# EAGLE design modbus (EAGLE 9.3.0)
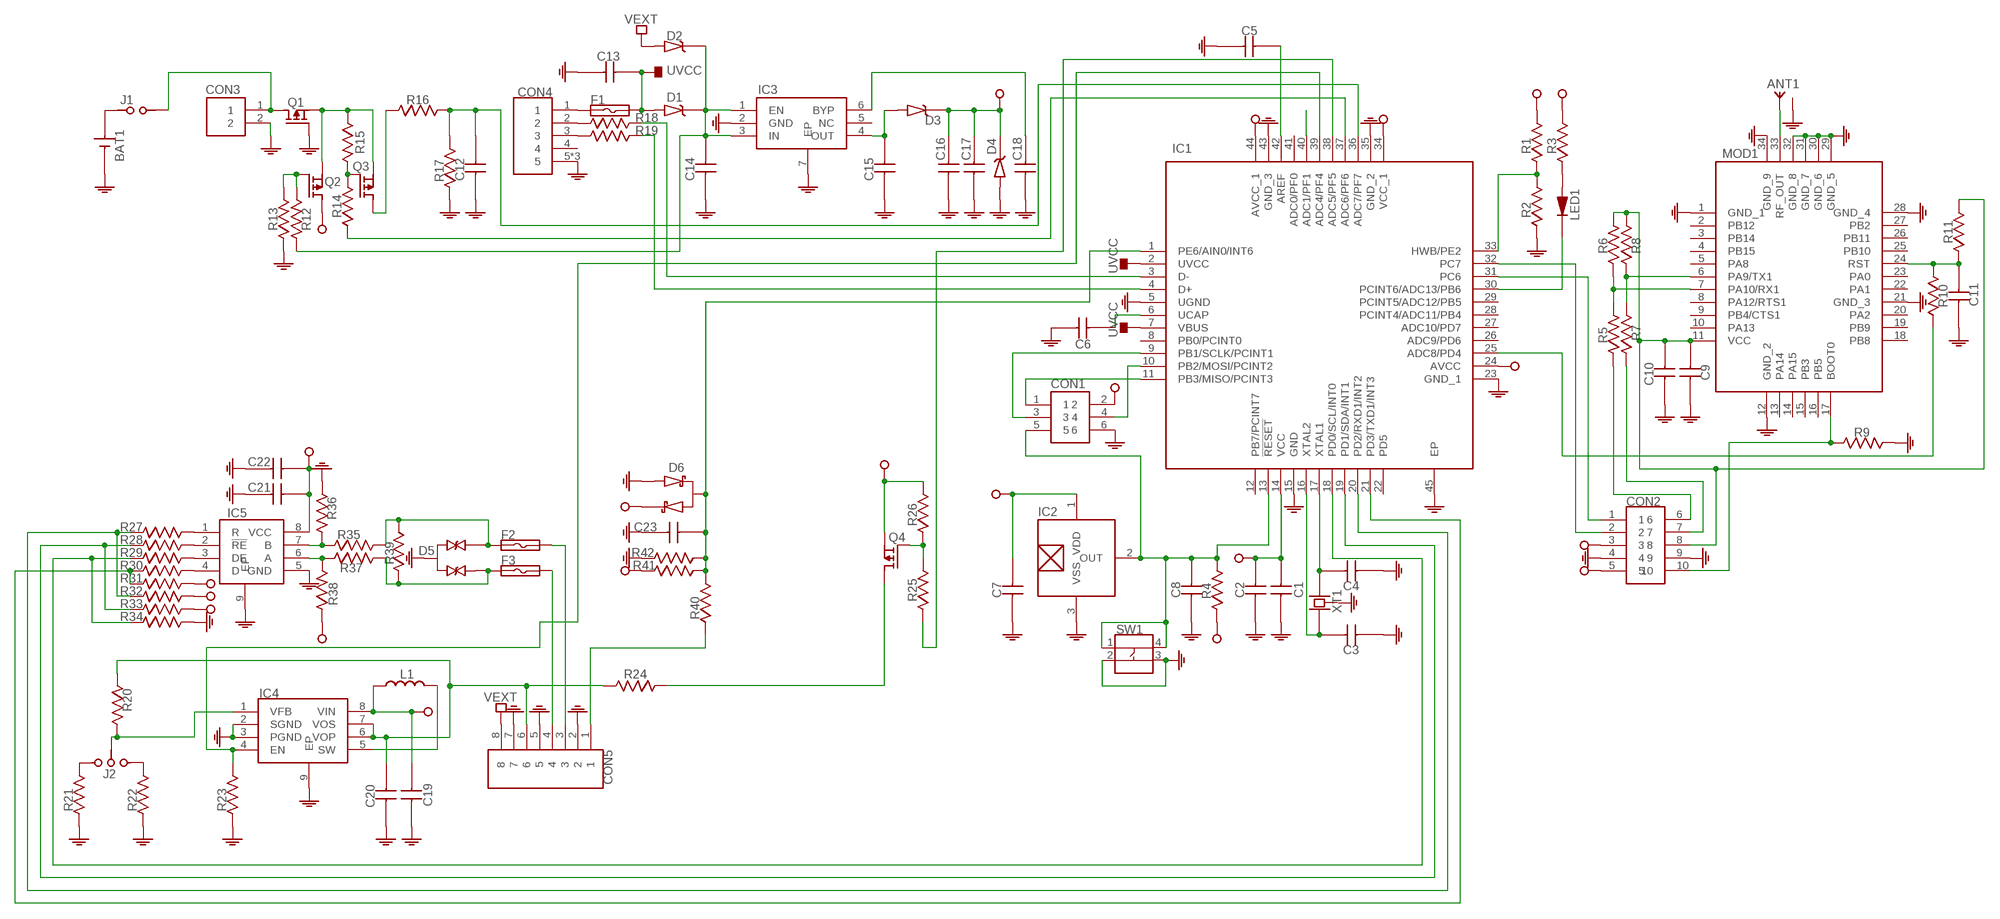
[diagram p0: schematic, sheet 1]

## Parts
ANT1  SMA-RF  [SMA-RF]
BAT1  211P-C-HOLDER  [211P-C-HOLDER]
C1  CAPACITOR-0603  [0603]
C2  CAPACITOR-0603  [0603]
C3  CAPACITOR-0603  [0603]
C4  CAPACITOR-0603  [0603]
C5  CAPACITOR-0603  [0603]
C6  CAPACITOR-0603  [0603]
C7  CAPACITOR-0603  [0603]
C8  CAPACITOR-0603  [0603]
C9  CAPACITOR-0603  [0603]
C10  CAPACITOR-0603  [0603]
C11  CAPACITOR-0603  [0603]
C12  CAPACITOR-0603  [0603]
C13  CAPACITOR-0603  [0603]
C14  CAPACITOR-0805  [0805]
C15  CAPACITOR-0805  [0805]
C16  CAPACITOR-0603  [0603]
C17  CAPACITOR-0603  [0603]
C18  CAPACITOR-0603  [0603]
C19  CAPACITOR-0805  [0805]
C20  CAPACITOR-0805  [0805]
C21  CAPACITOR-0603  [0603]
C22  CAPACITOR-0603  [0603]
C23  CAPACITOR-0603  [0603]
CON1  ISP  [ISP]
CON2  HEADER-10P-2R-DIP-2_54MM  [HEADER-10P-2R-DIP-2_54MM]
CON3  JST-PH-2-2.0MM  [JST-PH-2-2.0MM]
CON4  USB-MICRO-DIP-VER  [USB-MICRO-DIP-VER]
CON5  CON-3_50MM-8P-1985250  [CON-3_50MM-8P-1985250]
D1  DIODE-SCHOTTKY  [SOD123-DIODE]
D2  DIODE-SCHOTTKY  [SOD123-DIODE]
D3  DIODE-SCHOTTKY  [SOD123-DIODE]
D4  ZENER-SOD123  [SOD123-DIODE]
D5  TVS-DIODE-3P  [SOT23-3]
D6  SCHOTTKY-SERIE-3P  [SOT23-3]
F1  FUSE-1206  [1206]
F2  FUSE-1206  [1206]
F3  FUSE-1206  [1206]
IC1  ATMEGA32U4-MU  [QFN-44]
IC2  S-5712-SOT23-3  [SOT23-3]
IC3  MIC5219-VDFN-6  [VDFN-6]
IC4  MCP1640-DFN-8  [DFN-8-2X3]
IC5  SN65HVD72DRB  [VSON-8]
J1  JUMPER  [HEADER-2P-DIP-2_54MM]
J2  JUMPER-3P  [HEADER-3P-DIP-2_54MM]
L1  INDUCTOR-0520-0630  [INDUCTOR-0520-0630]
LED1  LED-0603  [LED-0603]
MOD1  RAK811  [RAK811]
Q1  P-MOSFET  [SOT23-3]
Q2  P-MOSFET  [SOT23-3]
Q3  P-MOSFET  [SOT23-3]
Q4  P-MOSFET  [SOT23-3]
R1  RESISTOR-0603  [0603]
R2  RESISTOR-0603  [0603]
R3  RESISTOR-0603  [0603]
R4  RESISTOR-0603  [0603]
R5  RESISTOR-0603  [0603]
R6  RESISTOR-0603  [0603]
R7  RESISTOR-0603  [0603]
R8  RESISTOR-0603  [0603]
R9  RESISTOR-0603  [0603]
R10  RESISTOR-0603  [0603]
R11  RESISTOR-0603  [0603]
R12  RESISTOR-0603  [0603]
R13  RESISTOR-0603  [0603]
R14  RESISTOR-0603  [0603]
R15  RESISTOR-0603  [0603]
R16  RESISTOR-0603  [0603]
R17  RESISTOR-0603  [0603]
R18  RESISTOR-0603  [0603]
R19  RESISTOR-0603  [0603]
R20  RESISTOR-0603  [0603]
R21  RESISTOR-0603  [0603]
R22  RESISTOR-0603  [0603]
R23  RESISTOR-0603  [0603]
R24  RESISTOR-0603  [0603]
R25  RESISTOR-0603  [0603]
R26  RESISTOR-0603  [0603]
R27  RESISTOR-0603  [0603]
R28  RESISTOR-0603  [0603]
R29  RESISTOR-0603  [0603]
R30  RESISTOR-0603  [0603]
R31  RESISTOR-0603  [0603]
R32  RESISTOR-0603  [0603]
R33  RESISTOR-0603  [0603]
R34  RESISTOR-0603  [0603]
R35  RESISTOR-0805  [0805]
R36  RESISTOR-0603  [0603]
R37  RESISTOR-0805  [0805]
R38  RESISTOR-0603  [0603]
R39  RESISTOR-JMP-2_54MM  [HEADER-2P-DIP-2_54MM]
R40  RESISTOR-0805  [0805]
R41  RESISTOR-JMP-2_54MM  [HEADER-2P-DIP-2_54MM]
R42  RESISTOR-JMP-2_54MM  [HEADER-2P-DIP-2_54MM]
SW1  BUTTON-4P-SMD-5X5  [BUTTON-4P-SMD-5X5]
XT1  CRYSTAL-5032-4P  [CRYSTAL-5032-4P]

## Nets
GND: ANT1.2(GND) ANT1.3(GND) ANT1.4(GND) ANT1.5(GND) BAT1.2(-) C1.1 C2.1 C3.1 C4.1 C5.1 C6.1 C7.1 C8.1 C9.1 C10.1 C11.1 C12.1 C13.1 C14.1 C15.1 C16.1 C17.1 C18.1 C19.1 C20.1 C21.1 C22.1 C23.1 CON1.6 CON2.4 CON2.9 CON3.2 CON4.5 CON4.6 CON4.7 CON5.2 CON5.5 CON5.7 D4.2(A) D5.3 D6.1 IC1.5(UGND) IC1.15(GND) IC1.23(GND_1) IC1.35(GND_2) IC1.43(GND_3) IC1.45(EP) IC2.3(VSS) IC3.2(GND) IC3.7(EP) IC4.2(SGND) IC4.3(PGND) IC4.9(EP) IC5.5(GND) IC5.9(EP) MOD1.1(GND_1) MOD1.12(GND_2) MOD1.21(GND_3) MOD1.28(GND_4) MOD1.29(GND_5) MOD1.30(GND_6) MOD1.31(GND_7) MOD1.32(GND_8) MOD1.34(GND_9) Q1.1(G) R2.1 R9.2 R13.1 R17.1 R21.1 R22.1 R23.1 R34.2 R36.1 R42.1 SW1.2 SW1.3
N$1: IC5.1(R) R27.2
N$2: C11.2 MOD1.24(RST) R10.1 R11.1
N$3: CON1.1 IC1.11(PB3/MISO/PCINT3)
N$4: ANT1.1(ANT) MOD1.33(RF_OUT)
N$5: CON5.4 F3.2
N$6: MOD1.7(PA10/RX1) R5.2 R6.1
N$7: MOD1.6(PA9/TX1) R7.2 R8.1
N$8: IC5.2(!RE) R28.2
N$9: CON1.4 IC1.10(PB2/MOSI/PCINT2)
N$10: C3.2 IC1.16(XTAL2) XT1.1
N$11: CON2.1 IC1.31(PC6)
N$12: C4.2 IC1.17(XTAL1) XT1.3
N$13: C9.2 C10.2 CON2.8 MOD1.11(VCC) R6.2 R8.2 R11.2
N$14: CON2.7 R7.1
N$15: C20.2 CON5.6 IC4.6(VOP) IC4.7(VOS) R20.1 R24.2
N$16: IC1.25(ADC8/PD4) R10.2
N$17: IC5.3(DE) R29.2
N$18: IC5.4(D) R30.2
N$19: IC1.30(PCINT6/ADC13/PB6) LED1.1(K)
N$20: CON4.1 F1.1
N$21: CON5.3 F2.2
N$22: IC4.1(VFB) J2.2 R20.2
N$23: IC5.7(B) R35.1 R36.2
N$24: IC5.6(A) R37.1 R38.2
N$25: CON5.1 R40.1
N$26: D5.2 F2.1 R35.2 R39.2
N$27: IC1.40(ADC1/PF1)
N$28: Q4.3(D) R24.1
N$29: CON2.2 IC1.32(PC7)
N$30: D5.1 F3.1 R37.2 R39.1
N$31: C5.2 IC1.42(AREF)
N$32: Q3.1(G) R14.2 R15.2
N$34: C6.2 IC1.6(UCAP)
N$35: LED1.2(A) R3.1
N$36: C12.2 IC1.36(ADC7/PF7) R16.2 R17.2
N$37: C18.2 IC3.6(BYP)
N$38: C14.2 D1.1(K) D2.1(K) IC3.1(EN) IC3.3(IN) R12.1
N$39: J2.1 R22.2
N$40: C15.2 D3.2(A) IC3.4(OUT)
N$41: CON4.2 R18.1
N$42: CON4.3 R19.1
N$43: IC1.3(D-) R18.2
N$44: IC1.4(D+) R19.2
N$45: CON1.3 IC1.9(PB1/SCLK/PCINT1)
N$46: Q4.1(G) R25.2 R26.1
N$47: IC1.37(ADC6/PF6) R14.1
N$49: J2.3 R21.2
N$50: IC1.38(ADC5/PF5) R25.1
N$51: BAT1.1(+) J1.1
N$52: IC1.18(PD0/SCL/INT0) R29.1 R34.1
N$53: Q2.1(G) R12.2 R13.2
N$54: IC1.19(PD1/SDA/INT1) R28.1 R33.1
N$55: CON3.1 J1.2 Q1.3(D)
N$56: C23.2 D6.3 IC1.1(PE6/AIN0/INT6) R40.2 R41.2 R42.2
N$57: IC1.20(PD2/RXD1/INT2) R27.1 R32.1
N$58: Q1.2(S) Q2.2(S) Q3.2(S) R15.1
N$59: Q3.3(D) R16.1
N$60: CON2.6 R5.1
N$61: IC1.33(HWB/PE2) R1.1 R2.2
N$62: IC1.21(PD3/TXD1/INT3) R30.1 R31.1
N$63: CON2.10 MOD1.17(BOOT0) R9.1
N$64: C8.2 CON1.5 IC1.13(!RESET) IC2.2(OUT) R4.2 SW1.1 SW1.4
N$65: IC4.5(SW) L1.2
N$66: IC1.39(ADC4/PF4) IC4.4(EN) R23.2
UVCC: C13.2 D1.2(A) F1.2 IC1.2(UVCC) IC1.7(VBUS)
VCC: C1.2 C2.2 C7.2 C16.2 C17.2 C19.2 C21.2 C22.2 CON1.2 CON2.3 CON2.5 D3.1(K) D4.1(K) D6.2 IC1.14(VCC) IC1.24(AVCC) IC1.34(VCC_1) IC1.44(AVCC_1) IC2.1(VDD) IC4.8(VIN) IC5.8(VCC) L1.1 Q2.3(D) Q4.2(S) R1.2 R3.2 R4.1 R26.2 R31.2 R32.2 R33.2 R38.1 R41.1
VEXT: CON5.8 D2.2(A)
Unconnected: CON4.4 IC1.8(PB0/PCINT0) IC1.12(PB7/PCINT7) IC1.22(PD5) IC1.26(ADC9/PD6) IC1.27(ADC10/PD7) IC1.28(PCINT4/ADC11/PB4) IC1.29(PCINT5/ADC12/PB5) IC1.41(ADC0/PF0) IC3.5(NC) MOD1.2(PB12) MOD1.3(PB14) MOD1.4(PB15) MOD1.5(PA8) MOD1.8(PA12/RTS1) MOD1.9(PB4/CTS1) MOD1.10(PA13) MOD1.13(PA14) MOD1.14(PA15) MOD1.15(PB3) MOD1.16(PB5) MOD1.18(PB8) MOD1.19(PB9) MOD1.20(PA2) MOD1.22(PA1) MOD1.23(PA0) MOD1.25(PB10) MOD1.26(PB11) MOD1.27(PB2)

## Power pins joined to a net without a drawn wire
GND: XT1.2(GND) XT1.4(GND)

## Library data of the parts
ANT1 = SamacSys_Parts:SMA-RF
BAT1 = SamacSys_Parts:211P-C-HOLDER
C1-C13 C16-C18 C21-C23 = SamacSys_Parts:CAPACITOR-0603
C14 C15 C19 C20 = SamacSys_Parts:CAPACITOR-0805
CON1 = SamacSys_Parts:ISP
CON2 = SamacSys_Parts:HEADER-10P-2R-DIP-2_54MM
CON3 = SamacSys_Parts:JST-PH-2-2.0MM
CON4 = SamacSys_Parts:USB-MICRO-DIP-VER
CON5 = SamacSys_Parts:CON-3_50MM-8P-1985250
D1-D3 = SamacSys_Parts:DIODE-SCHOTTKY
D4 = SamacSys_Parts:ZENER-SOD123
D5 = SamacSys_Parts:TVS-DIODE-3P
D6 = SamacSys_Parts:SCHOTTKY-SERIE-3P
F1-F3 = SamacSys_Parts:FUSE-1206
IC1 = SamacSys_Parts:ATMEGA32U4-MU
IC2 = SamacSys_Parts:S-5712-SOT23-3
IC3 = SamacSys_Parts:MIC5219-VDFN-6
IC4 = SamacSys_Parts:MCP1640-DFN-8
IC5 = SamacSys_Parts:SN65HVD72DRB
J1 = SamacSys_Parts:JUMPER
J2 = SamacSys_Parts:JUMPER-3P
L1 = SamacSys_Parts:INDUCTOR-0520-0630
LED1 = SamacSys_Parts:LED-0603
MOD1 = SamacSys_Parts:RAK811
Q1-Q4 = SamacSys_Parts:P-MOSFET
R1-R34 R36 R38 = SamacSys_Parts:RESISTOR-0603
R35 R37 R40 = SamacSys_Parts:RESISTOR-0805
R39 R41 R42 = SamacSys_Parts:RESISTOR-JMP-2_54MM
SW1 = SamacSys_Parts:BUTTON-4P-SMD-5X5
XT1 = SamacSys_Parts:CRYSTAL-5032-4P

## Board
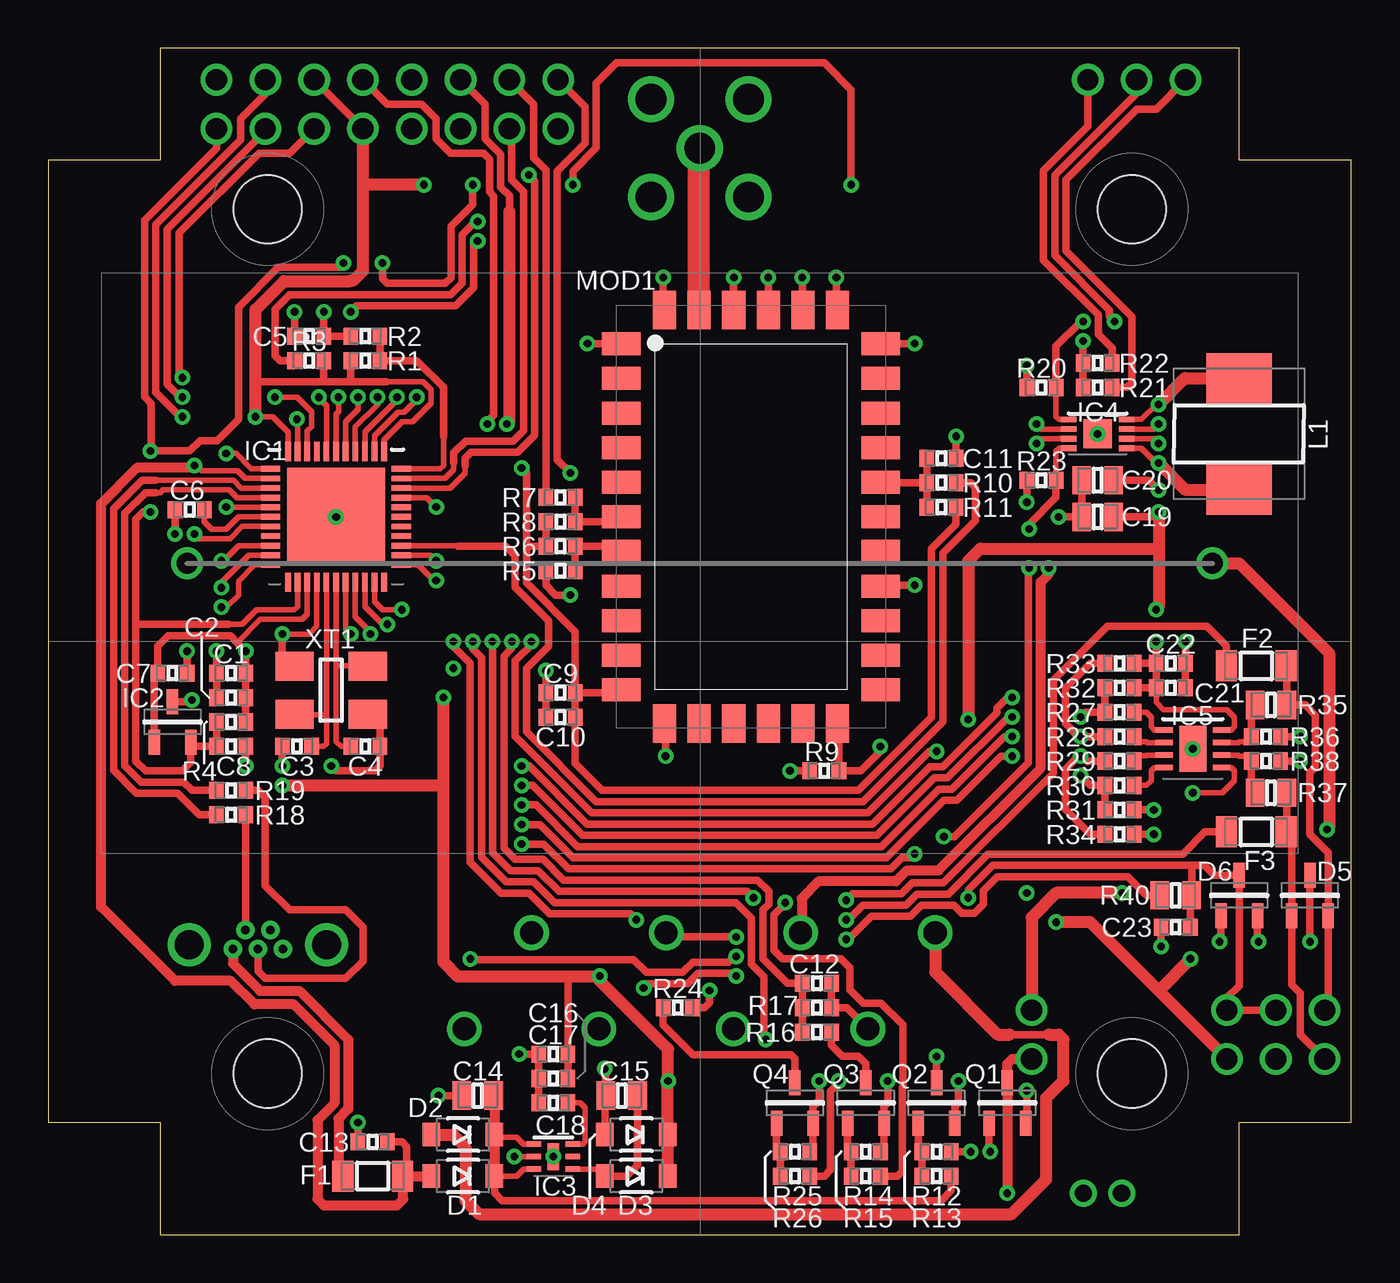
[diagram p1: board, top side]
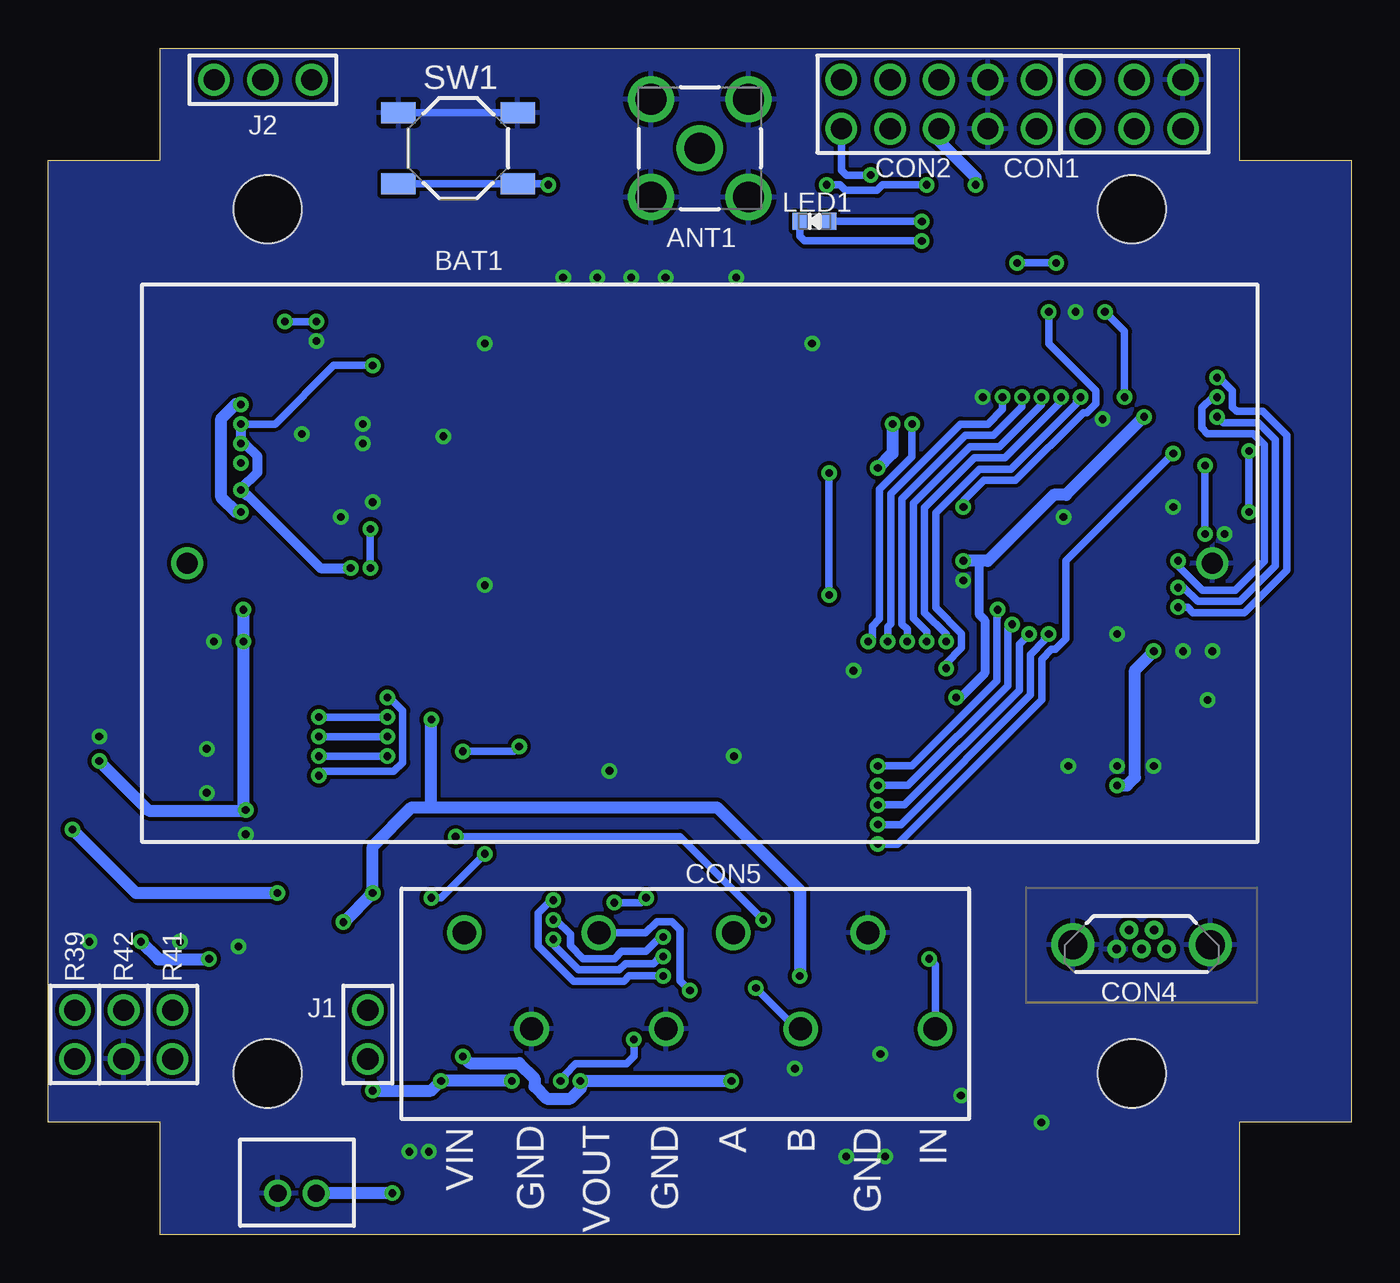
[diagram p2: board, bottom side, seen from below]

Size 67.82 x 61.72 mm. Coordinates in mm from the lower left corner, seen from the top.
Outline: 0,5.84 5.84,5.84 5.84,0 61.98,0 61.98,5.84 67.82,5.84 67.82,55.88 61.98,55.88 61.98,61.72 5.84,61.72 5.84,55.88 0,55.88 0,5.84
Copper layers (1*16): Top 0.035mm / dielectric 1.5mm / Bottom 0.035mm
Design rules "qfn": minimum track width 10mil, minimum drill 0.4mm, track to track 8mil, track to pad 10mil, pad to pad 8mil, via to via 8mil, smd to smd 0mil, copper to edge 0mil, drill to drill 6mil, minimum pad ring 10mil, minimum via ring 8mil, stop-mask expansion 4mil, vias tented up to drill 25mil, thermal gap 10mil
Holes 3.56 mm at 11.43,8.38 56.39,8.38 56.39,53.34 11.43,53.34
bRestrict: area 27.7,52.2 to 28.2,53.2

### Footprints (pad centres in the part's own frame; a part is rotated, then mirrored left to right if it is on the bottom)
SMA-RF = drill 1.6: 1 0,0; 2 -2.54,2.54; 3 -2.54,-2.54; 4 2.54,-2.54; 5 2.54,2.54
211P-C-HOLDER = drill 1.1: 1 -26.67,0; 2 26.67,0
0603 = smd 0.762 x 0.889: 1 -0.762,0; 2 0.762,0
0805 = smd 0.97 x 1.47: 1 -0.83,0; 2 0.83,0
ISP = drill 1.1 pad 1.65: 1 0,0; 2 2.54,0; 3 0,-2.54; 4 2.54,-2.54; 5 0,-5.08; 6 2.54,-5.08
HEADER-10P-2R-DIP-2_54MM = drill 1.1 pad 1.65: 1 0,0; 2 2.54,0; 3 5.08,0; 4 7.62,0; 5 10.16,0; 6 0,2.54; 7 2.54,2.54; 8 5.08,2.54; 9 7.62,2.54; 10 10.16,2.54
JST-PH-2-2.0MM = drill 0.9: 1 -1,0; 2 1,0
USB-MICRO-DIP-VER = drill 0.45: 1 -1.3,0; 2 -0.65,-1; 3 0,0; 4 0.65,-1; 5 1.3,0 | drill 1.5: 6 -3.575,-0.22; 7 3.575,-0.22
CON-3_50MM-8P-1985250 = drill 1.2: 1 12.25,-2.5; 2 8.75,2.5; 3 5.25,-2.5; 4 1.75,2.5; 5 -1.75,-2.5; 6 -5.25,2.5; 7 -8.75,-2.5; 8 -12.25,2.5
SOD123-DIODE = smd 0.91 x 1.22: 1 -1.635,0; 2 1.635,0
SOT23-3 = smd 1.3 x 0.6: 1 -1.05,0.95; 2 -1.05,-0.95; 3 1.05,0
1206 = smd 1.1 x 1.6: 1 -1.55,0; 2 1.55,0
QFN-44 = smd 1 x 0.3: 1 -3.4,2.5; 2 -3.4,2; 3 -3.4,1.5; 4 -3.4,1; 5 -3.4,0.5; 6 -3.4,0; 7 -3.4,-0.5; 8 -3.4,-1; 9 -3.4,-1.5; 10 -3.4,-2; 11 -3.4,-2.5; 23 3.4,-2.5; 24 3.4,-2; 25 3.4,-1.5; 26 3.4,-1; 27 3.4,-0.5; 28 3.4,0; 29 3.4,0.5; 30 3.4,1; 31 3.4,1.5; 32 3.4,2; 33 3.4,2.5 | smd 0.3 x 1: 12 -2.5,-3.4; 13 -2,-3.4; 14 -1.5,-3.4; 15 -1,-3.4; 16 -0.5,-3.4; 17 0,-3.4; 18 0.5,-3.4; 19 1,-3.4; 20 1.5,-3.4; 21 2,-3.4; 22 2.5,-3.4; 34 2.5,3.4; 35 2,3.4; 36 1.5,3.4; 37 1,3.4; 38 0.5,3.4; 39 0,3.4; 40 -0.5,3.4; 41 -1,3.4; 42 -1.5,3.4; 43 -2,3.4; 44 -2.5,3.4 | smd 5.1 x 5.1: 45 0,0
VDFN-6 = smd 0.75 x 0.3: 1 -1.025,0.65; 2 -1.025,0; 3 -1.025,-0.65; 4 1.025,-0.65; 5 1.025,0; 6 1.025,0.65 | smd 0.6 x 1.4: 7 0,0
DFN-8-2X3 = smd 0.8 x 0.3: 1 -1.5,0.75; 2 -1.5,0.25; 3 -1.5,-0.25; 4 -1.5,-0.75; 5 1.5,-0.75; 6 1.5,-0.25; 7 1.5,0.25; 8 1.5,0.75 | smd 1.5 x 1.5: 9 0,0
VSON-8 = smd 0.9 x 0.3: 1 -1.5,0.975; 2 -1.5,0.325; 3 -1.5,-0.325; 4 -1.5,-0.975; 5 1.5,-0.975; 6 1.5,-0.325; 7 1.5,0.325; 8 1.5,0.975 | smd 1.4 x 2.4: 9 0,0
HEADER-2P-DIP-2_54MM = drill 1.1 pad 1.65: 1 0,-1.27; 2 0,1.27
HEADER-3P-DIP-2_54MM = drill 1.1 pad 1.65: 1 0,-2.54; 2 0,0; 3 0,2.54
INDUCTOR-0520-0630 = smd 2.6 x 3.4: 1 -2.9,0; 2 2.9,0
LED-0603 = smd 0.762 x 0.889: 1 -0.762,0; 2 0.762,0
RAK811 = smd 2 x 1.2: 1 -6.75,9; 2 -6.75,7.2; 3 -6.75,5.4; 4 -6.75,3.6; 5 -6.75,1.8; 6 -6.75,0; 7 -6.75,-1.8; 8 -6.75,-3.6; 9 -6.75,-5.4; 10 -6.75,-7.2; 11 -6.75,-9; 18 6.75,-9; 19 6.75,-7.2; 20 6.75,-5.4; 21 6.75,-3.6; 22 6.75,-1.8; 23 6.75,0; 24 6.75,1.8; 25 6.75,3.6; 26 6.75,5.4; 27 6.75,7.2; 28 6.75,9 | smd 1.2 x 2: 12 -4.5,-10.75; 13 -2.7,-10.75; 14 -0.9,-10.75; 15 0.9,-10.75; 16 2.7,-10.75; 17 4.5,-10.75; 29 4.5,10.75; 30 2.7,10.75; 31 0.9,10.75; 32 -0.9,10.75; 33 -2.7,10.75; 34 -4.5,10.75
BUTTON-4P-SMD-5X5 = smd 1.8 x 1.1: 1 -3.1,1.85; 2 -3.1,-1.85; 3 3.1,-1.85; 4 3.1,1.85
CRYSTAL-5032-4P = smd 2 x 1.5: 1 -1.9,-1.25; 2 1.9,-1.25; 3 1.9,1.25; 4 -1.9,1.25

### Placement (x,y rotation side)
ANT1  33.91,56.52 0 bottom
BAT1  33.91,34.92 0 bottom
C1  9.53,29.21 0 top
C2  9.53,27.94 0 top
C3  12.95,25.4 0 top
C4  16.51,25.4 180 top
C5  13.59,46.74 180 top
C6  7.37,37.72 0 top
C7  6.48,29.21 180 top
C8  9.53,25.4 180 top
C9  26.67,28.19 0 top
C10  26.67,26.92 0 top
C11  46.48,40.39 180 top
C12  40.01,13.08 180 top
C13  16.89,4.83 0 top
C14  22.35,7.24 0 top
C15  29.84,7.24 0 top
C16  26.29,8.13 0 top
C17  26.29,9.4 0 top
C18  26.29,6.86 0 top
C19  54.61,37.34 0 top
C20  54.61,39.24 0 top
C21  58.42,28.45 180 top
C22  58.42,29.72 180 top
C23  58.67,16 0 top
CON1  13.84,57.53 90 bottom
CON2  26.54,57.53 0 bottom
CON3  54.86,2.16 180 bottom
CON4  10.92,14.86 180 bottom
CON5  33.91,13.21 0 bottom
D1  21.59,3.05 180 top
D2  21.59,5.21 180 top
D3  30.61,3.05 180 top
D4  30.61,5.21 180 top
D5  65.66,17.65 90 top
D6  61.98,17.65 90 top
F1  16.89,3.05 0 top
F2  62.87,29.59 180 top
F3  62.87,20.95 180 top
IC1  14.99,37.34 0 top
IC2  6.48,26.67 90 top
IC3  26.29,4.06 0 top
IC4  54.61,41.66 0 top
IC5  59.56,25.27 0 top
J1  51.18,10.41 180 bottom
J2  56.64,60.07 90 bottom
L1  61.98,41.66 270 top
LED1  27.94,52.7 0 bottom
MOD1  36.58,37.34 0 top
Q1  49.91,6.86 90 top
Q2  46.23,6.86 90 top
Q3  42.55,6.86 90 top
Q4  38.86,6.86 90 top
R1  16.51,45.47 180 top
R2  16.51,46.74 0 top
R3  13.59,45.47 0 top
R4  9.53,26.67 180 top
R5  26.67,34.54 0 top
R6  26.67,35.81 180 top
R7  26.67,38.35 0 top
R8  26.67,37.08 180 top
R9  40.39,24.13 180 top
R10  46.48,39.12 0 top
R11  46.48,37.85 0 top
R12  46.23,3.05 180 top
R13  46.23,4.32 180 top
R14  42.55,3.05 180 top
R15  42.55,4.32 180 top
R16  40.01,10.54 180 top
R17  40.01,11.81 180 top
R18  9.53,21.84 180 top
R19  9.53,23.11 180 top
R20  51.69,44.07 0 top
R21  54.61,44.07 0 top
R22  54.61,45.34 0 top
R23  51.69,39.24 0 top
R24  32.77,11.81 0 top
R25  38.86,3.05 180 top
R26  38.86,4.32 0 top
R27  55.75,27.18 0 top
R28  55.75,25.91 0 top
R29  55.75,24.64 0 top
R30  55.75,23.37 0 top
R31  55.75,22.1 0 top
R32  55.75,28.45 0 top
R33  55.75,29.72 0 top
R34  55.75,20.83 0 top
R35  63.63,27.56 0 top
R36  63.37,25.91 180 top
R37  63.63,22.99 0 top
R38  63.37,24.64 180 top
R39  66.42,10.41 0 bottom
R40  58.67,17.65 0 top
R41  61.34,10.41 0 bottom
R42  63.88,10.41 0 bottom
SW1  46.48,56.52 180 bottom
XT1  14.73,28.32 0 top

### Tracks (layer width: path | path; a pad name or v marks a point on that pad's centre or on a via)
GND  (via drill 0.4)
  Top 0.292: IC1.43 12.99,42.39 v12.95,42.42 | IC1.35 16.99,41.5 16.99,41.57 18.21,42.79 18.53,42.79 19.18,43.43 v19.18,43.56 | IC1.5 9.28,37.84 v9.27,37.85 | IC1.15 13.99,31.64 13.58,31.24 v12.2,31.24 v12.19,31.24 | IC3.2 v24.26,4.06 | IC1.23 19.26,34.84 20.07,34.04 v20.19,34.04 | IC4.2 51.69,41.91 v51.44,42.16 | IC4.3 51.69,41.41 v51.44,41.15 | IC5.5 61.55,24.3 61.72,24.13 61.72,23.62 61.09,22.99 v59.56,22.99
  Top 0.381: C3.1 v12.19,24.38 | v14.73,24.38 14.99,24.13 17.02,24.13 17.27,24.38 C4.1 17.27,26.43 XT1.2 | C8.1 v10.29,24.38 | C7.1 v7.24,30.35 | IC2.3 7.4,27.72 v7.49,27.81 | v8.76,30.35 C1.1 C2.1 | MOD1.34 32,48.16 v32,49.78 | MOD1.1 29.81,46.35 v28.07,46.35 | MOD1.32 35.68,49.77 v35.69,49.78 | MOD1.31 v37.48,49.77 v37.47,49.78 | MOD1.30 39.24,48.12 v39.24,49.78 | MOD1.29 41.02,48.14 v41.02,49.78 | MOD1.28 43.34,46.35 v45.09,46.35 | MOD1.21 43.37,33.78 v45.09,33.78 | MOD1.12 32.13,26.53 v32.13,24.89 | C10.1 C9.1 v25.91,29.34 | C6.1 v6.6,36.45 | R9.2 v38.61,24.13 | C14.1 v20.32,7.24 | v16.13,5.84 C13.1 | C18.1 C16.1 C17.1 v24.51,9.4 | D4.2 28.97,7.2 C15.1 29.02,8.58 v28.96,8.64 | CON5.7 41.56,11.81 R17.1 C12.1 | R13.1 v48.01,4.32 | Q1.1 48.96,4.38 v49.02,4.32 | R2.1 C5.1 v14.35,48.01 | C11.1 v47.24,41.53 | v12.19,31.24 12.19,30.21 XT1.4 | C20.1 C19.1 v52.58,37.34 | R23.1 v50.93,38.1 | R21.1 R22.1 v53.85,46.48 | D6.1 61.03,15.31 v60.96,15.24 | C23.1 v57.91,14.99 | C21.1 C22.1 v59.18,30.86 | R36.1 v65.15,25.91 | R34.2 v57.53,20.83 | D5.3 v65.66,15.24
  Bottom 0.381: SW1.2 SW1.3
  other vias: 14.99,37.34 26.29,4.06 59.56,25.27 54.61,41.66
  pour Bottom: 0.13,5.97 0.13,55.75 5.97,55.75 5.97,61.59 61.85,61.59 61.85,55.75 67.69,55.75 67.69,5.97 61.85,5.97 61.85,0.13 5.97,0.13 5.97,5.97
N$1
  Top 0.292: IC5.1 57.57,26.25 57.4,26.42 57.4,26.92 57.15,27.18 R27.2
N$2
  Top 0.381: R10.1 R11.1 | MOD1.24 43.35,39.12 R10.1 | R10.1 C11.2
N$3  (via drill 0.4)
  Top 0.292: IC1.11 10.76,34.84 9.91,33.99 9.91,33.27 9.27,32.64 v9.02,32.64
  Top 0.381: CON1.1 12.57,56.26 10.99,56.26 6.83,52.11 6.83,44.73 v6.99,44.58
  Bottom 0.381: v6.99,44.58 6.87,44.58 6.19,43.89 6.19,43.04 5.97,42.82 4.61,42.82 3.37,41.58 3.37,34.55 5.56,32.36 8.25,32.36 8.53,32.64 v9.02,32.64
N$4
  Top 1.143: MOD1.33 33.88,56.48 ANT1.1
N$5  (via drill 0.4)
  Top 0.381: v35.81,15.49 32.37,15.49 CON5.4 | v41.53,16.38 41.64,16.38 42.4,17.14 44.64,17.14 45.21,17.72 46.84,17.72 48.91,19.79 59.04,19.79 60.2,20.95 F3.2
  Bottom 0.381: v41.53,16.38 41.4,16.38 40.64,15.62 40.64,15.03 39.97,14.36 38.34,14.36 37.97,14.73 36.7,14.73 35.94,15.49 v35.81,15.49
N$6
  Top 0.381: R5.2 R6.1 29.55,35.81 MOD1.7
N$7
  Top 0.381: R7.2 R8.1 29.57,37.08 MOD1.6
N$8
  Top 0.292: IC5.2 57.21,25.6 57.15,25.65 56.77,25.65 R28.2
N$9  (via drill 0.4)
  Top 0.292: IC1.10 10.45,35.34 9.02,33.91 v9.02,33.66
  Top 0.381: CON1.4 11.3,59.33 10.03,58.06 10.03,56.96 5.6,52.53 5.6,43.81 6.87,42.55 v6.99,42.55
  Bottom 0.381: v6.99,42.55 6.68,42.24 4.85,42.24 3.95,41.34 3.95,34.8 5.81,32.94 8.01,32.94 8.72,33.66 v9.02,33.66
N$10
  Top 0.292: IC1.16 14.49,27.05 | 14.49,27.05 14.49,25.54 14.35,25.4 C3.2 | XT1.1 12.85,27.05 14.49,27.05
N$11  (via drill 0.4)
  Top 0.292: IC1.31 20.93,38.84 21.7,39.6 21.7,40.01
  Top 0.381: v25.02,55.12 25.32,54.81 25.32,41.58 24.43,40.69 22,40.69 21.7,40.39 21.7,40.01
  Bottom 0.381: v25.02,55.12 26.29,55.12 26.54,55.37 CON2.1
N$12
  Top 0.292: IC1.17 14.99,29.59 | 14.99,29.59 14.99,25.65 15.24,25.4 C4.2 | XT1.3 16.61,29.59 14.99,29.59
N$13  (via drill 0.4)
  Top 0.381: C9.2 C10.2 27.43,24.51 28.83,23.11 42.16,23.11 45.97,26.92 45.97,35.69 47.24,36.96 R11.2 | C9.2 29.68,28.19 MOD1.11 | R8.2 R6.2 24.89,35.81 | C9.2 27.43,31.37 24.89,33.91 24.89,35.81 | v24.64,39.88 24.89,39.62 24.89,35.81 | CON2.8 22.73,58.8 22.73,57.01 23.55,56.19 23.55,54.49 24,54.04 24,53.21
  Top 0.635: v23.88,42.16 24,42.29 24,53.21
  Bottom 0.635: v23.88,42.16 23.88,40.64 v24.64,39.88
N$14
  Top 0.381: CON2.7 25.27,58.8 25.27,56.01 25.91,55.37 R7.1
N$15  (via drill 0.4)
  Top 0.292: IC4.6 57.53,41.41 v57.78,41.15 | IC4.7 57.53,41.91 v57.78,42.16
  Top 0.381: R20.1 v50.93,45.21 | v57.78,38.73 57.28,39.24 C20.2 | R24.2 34.16,11.81 34.42,12.06 v34.42,12.7
  Top 0.508: v52.07,34.67 52.07,34.37 51.65,33.95 51.65,24.27 46.33,18.95 44.7,18.95 44.13,18.38 40.09,18.38 39.21,17.5 39.21,15.76 CON5.6
  Bottom 0.381: v57.78,42.16 56.01,42.16 52.96,45.21 v50.93,45.21 | v34.42,12.7 34.92,13.21 34.92,15.86 35.36,16.29 36.14,16.29 36.73,15.71 CON5.6
  Bottom 0.508: v57.78,42.16 v57.78,41.15 57.58,41.15 56.92,40.49 56.92,39.65 57.78,38.79 v57.78,38.73 57.5,38.45 57.43,38.45 53.65,34.67 v52.07,34.67
N$16
  Top 0.292: 21.34,35.81 21.31,35.84 IC1.25
  Top 0.381: R10.2 48.01,39.12 48.26,38.86 48.26,37.15 46.56,35.45 46.56,26.68 42.41,22.53 28.52,22.53 24.89,26.16 24.89,29.46 26.04,30.61 26.04,31.94 24.31,33.67 24.31,35.31 23.8,35.81 21.34,35.81
N$17
  Top 0.292: IC5.3 57.14,24.95 57.12,24.93 56.8,24.93 R29.2
N$18
  Top 0.292: IC5.4 57.57,24.3 57.4,24.13 57.4,23.62 57.15,23.37 R30.2
N$19  (via drill 0.4)
  Top 0.292: IC1.30 19.7,38.34 v20.19,37.85
  Top 0.381: v15.75,48.01 16.05,48.31 21.2,48.31 22.14,49.25 22.14,51.48 v22.35,51.69
  Bottom 0.381: LED1.1 28.7,51.94 28.45,51.69 v22.35,51.69 | v15.75,48.01 15.75,46.34 13.3,43.89 13.3,43.23 13.77,42.76 13.96,42.76 17.48,39.24 19.13,39.24 20.17,38.2 20.17,37.87 v20.19,37.85
N$20
  Top 0.508: CON4.1 9.62,14.1 11.04,12.69 13.08,12.69 15.62,10.15 15.62,6.55 15.11,6.04 15.11,3.28 F1.1
N$21  (via drill 0.4)
  Top 0.381: v30.99,12.83 31.22,13.06 33.27,13.06 33.81,13.6 35.68,13.6 v35.81,13.46 | v41.53,17.4 41.86,17.73 44.39,17.73 44.97,18.3 46.6,18.3 52.3,24 52.3,28.83 55.13,31.66 60.29,31.66 61.31,30.63 F2.2
  Bottom 0.381: CON5.3 28.87,10.71 v30.99,12.83 | v35.81,13.46 37.59,13.46 37.86,13.2 40.48,13.2 42.33,15.04 42.33,16.71 41.64,17.4 v41.53,17.4
N$22  (via drill 0.4)
  Top 0.292: IC4.1 52.59,42.41 52.45,42.55 R20.2
  Top 0.381: R20.2 52.45,46.21 53.74,47.5 v53.85,47.5 | v55.5,47.5 55.23,47.77 55.23,48.09 52.38,50.94 52.38,55.11 56.64,59.37 J2.2
  Bottom 0.381: v53.85,47.5 v55.5,47.5
N$23
  Top 0.292: IC5.7 61.92,25.6 61.98,25.65 62.36,25.65 R36.2
  Top 0.381: R36.2 62.61,27.37 R35.1
N$24
  Top 0.292: IC5.6 61.92,24.95 61.98,24.89 62.36,24.89 R38.2
  Top 0.381: R38.2 62.61,23.17 R37.1
N$25  (via drill 0.4)
  Top 0.381: v21.97,14.35 22.02,14.3 30.47,14.3 31.13,13.64 33.02,13.64 33.57,14.18 35.39,14.18 35.69,14.48 v35.81,14.48 | v41.53,15.37 41.64,15.37 42.83,16.56 44.88,16.56 45.45,17.14 47.14,17.14 47.55,16.73 48.21,16.73 48.68,17.2 48.68,17.9 49.4,18.62 56.18,18.62 57.15,17.65 R40.1
  Bottom 0.381: CON5.1 21.66,14.04 v21.97,14.35 | v35.81,14.48 35.94,14.48 36.32,14.1 37.78,14.1 38.1,13.78 40.21,13.78 41.53,15.1 v41.53,15.37
N$26
  Top 0.381: F2.1 64.46,29.55 R35.2 65.41,27.56 65.95,27.02 65.95,24.31 65.66,24.02 65.66,20.83 66.61,19.88 D5.2 66.61,11.87 R39.2
N$27  (via drill 0.4)
  Top 0.292: v14.1,43.56 14.1,43.51 14.49,43.12 IC1.40
  Bottom 0.381: v14.1,43.56 14.32,43.34 14.32,43.23 17.72,39.83 19.37,39.83 21.63,37.56 21.63,32.6 20.29,31.25 20.29,30.53 21.08,29.73 v21.08,29.46
N$28
  Top 0.381: Q4.3 38.86,9.14 38.64,9.36 33.55,9.36 32,10.91 R24.1
N$29
  Top 0.292: IC1.32 20.67,39.34 21.11,39.78 21.11,40.16
  Top 0.381: CON2.2 24.13,57.4 24.13,54.86 24.74,54.25 24.74,41.82 24.19,41.27 21.72,41.27 21.11,40.67 21.11,40.16
N$30
  Top 0.381: R37.2 64.46,21 | 64.46,21 F3.1 | R39.1 65.15,10.41 65.15,12.57 64.71,13.02 D5.1 64.71,20.75 64.46,21
N$31  (via drill 0.4)
  Top 0.292: IC1.42 13.49,41.81 13.72,42.04 13.72,42.8 12.95,43.56 v11.81,43.56
  Top 0.381: C5.2 v12.83,48.01
  Bottom 0.381: v11.81,43.56 11.81,46.99 v12.83,48.01
N$32
  Top 0.381: Q3.1 41.59,4.51 R15.2 R14.2
N$34
  Top 0.292: IC1.6 9.91,37.34 9.27,36.7 8.51,36.7 8.13,37.08 C6.2
N$35  (via drill 0.4)
  Top 0.381: R3.1 12.06,45.47 11.81,45.72 11.81,48.13 12.57,48.9 20.95,48.9 21.55,49.49 21.55,52.02 22.24,52.7 v22.35,52.7
  Bottom 0.381: LED1.2 v22.35,52.7
N$36  (via drill 0.4)
  Top 0.292: IC1.36 16.49,41.63 16.49,41.64 16.49,41.77 18.16,43.44 v18.16,43.56
  Top 0.381: R16.2 R17.2 C12.2 38.48,13.08 37.2,14.37 37.2,16.89 37.5,17.2 37.5,17.86 36.92,18.44 26.83,18.44 25.75,19.52 24.31,19.52 23.72,20.11 23.72,30.1 24.13,30.5 v24.13,30.86
  Bottom 0.381: v24.13,30.86 24.13,31.62 23.97,31.79 23.97,38.53 20.34,42.16 18.92,42.16 18.16,42.93 v18.16,43.56
N$37
  Top 0.292: IC3.6 27.83,4.71 27.94,4.83 27.94,6.6 27.69,6.86 C18.2
N$38
  Top 0.292: IC3.1 24.75,4.71 24.38,5.08 23.35,5.08 D2.1 | IC3.3 24.75,3.41 24.38,3.05 D1.1
  Top 0.381: R12.1 46.99,2.29 46.48,1.78 23.62,1.78 23.23,2.17 D1.1
  Top 0.508: D1.1 D2.1 23.23,7.2 C14.2
N$39
  Top 0.381: R22.2 55.37,46.1 54.65,46.83 54.65,47.84 51.79,50.7 51.79,55.35 54.1,57.66 J2.1
N$40
  Top 0.292: IC3.4 28.61,3.41 D3.2
  Top 0.381: C15.2 30.68,3.62 30.1,3.05 D3.2
N$41
  Top 0.381: R18.1 10.29,19.3 10.27,19.29 CON4.2
N$42
  Top 0.381: CON4.3 10.92,13.72 11.3,13.34 15.49,13.34 16.38,14.22 16.38,16 15.49,16.89 12.57,16.89 11.3,18.16 11.3,22.73 10.92,23.11 R19.1
N$43
  Top 0.292: IC1.3 10.06,38.84 9.65,39.24 5.59,39.24
  Top 0.381: 5.59,39.24 4.89,39.24 3.4,37.76 3.4,24.15 4.6,22.96 6.76,22.96 7.87,21.84 R18.2
N$44
  Top 0.292: IC1.4 9.84,38.34 9.43,38.75 5.98,38.75 5.83,38.6 5.6,38.6
  Top 0.381: 5.6,38.6 5.07,38.6 3.99,37.52 3.99,24.4 4.84,23.55 7.06,23.55 7.49,23.11 R19.2
N$45  (via drill 0.4)
  Top 0.292: IC1.9 9.93,35.84 9.14,35.05 v9.02,35.05
  Top 0.381: CON1.3 11.3,57.4 6.19,52.29 6.19,44.25 6.87,43.56 v6.99,43.56
  Bottom 0.381: v6.99,43.56 7.22,43.56 7.78,43 7.78,41.96 7.49,41.67 7.49,41.66 5.1,41.66 4.54,41.1 4.54,35.04 6.05,33.53 7.76,33.53 9.02,34.78 v9.02,35.05
N$46
  Top 0.381: R25.2 R26.1 37.91,4.51 Q4.1
N$47  (via drill 0.4)
  Top 0.292: IC1.37 15.99,42.02 17.14,43.18 v17.14,43.56
  Top 0.381: v23.11,30.86 23.11,30.62 23.14,30.6 23.14,19.86 24.07,18.94 25.51,18.94 26.59,17.86 36.37,17.86 v36.7,17.53 | R14.1 44.2,3.05 44.45,3.3 44.45,7.64 44.48,7.67 44.48,10.91 43.34,12.05 42.43,12.05 41.73,12.75 41.73,13.89 41.26,14.36 38.22,14.36 37.78,14.8 37.78,16.65 38.35,17.22 v38.35,17.27
  Bottom 0.381: v38.35,17.27 36.96,17.27 v36.7,17.53 | v17.14,43.56 17.14,43.07 18.63,41.58 20.09,41.58 23.38,38.29 23.38,31.75 23.11,31.48 v23.11,30.86
N$49
  Top 0.381: R21.2 56.13,44.07 56.39,44.32 56.39,47.75 52.96,51.18 52.96,54.86 56.64,58.55 57.66,58.55 J2.3
N$50  (via drill 0.4)
  Top 0.292: IC1.38 15.49,42.28 16.13,42.93 v16.13,43.56
  Top 0.381: v22.1,30.86 22.1,30.48 22.55,30.02 22.55,19.62 23.82,18.36 25.26,18.36 26.35,17.27 35.8,17.27 36.61,16.46 36.61,14.07 37.26,13.42 37.26,10.24 v37.34,10.16 | v41.15,8 41.15,7.89 40.72,7.46 40.72,3.38 40.39,3.05 R25.1
  Bottom 0.381: v16.13,43.56 16.13,43.18 18.31,41 19.85,41 22.8,38.05 22.8,32.05 22.1,31.35 v22.1,30.86 | v41.15,8 40.93,8.22 40.93,8.33 40.37,8.89 37.72,8.89 37.34,9.27 v37.34,10.16
N$51  (via drill 0.4)
  Top 0.635: BAT1.1 61.98,34.92 66.66,30.24 66.66,21.19 v66.55,21.08 | v55.88,17.78 52.45,17.78 51.18,16.51 J1.1
  Bottom 0.635: v66.55,21.08 63.25,17.78 v55.88,17.78
N$52  (via drill 0.4)
  Top 0.292: IC1.18 15.49,31.5 v15.75,31.24
  Top 0.381: R34.1 54.23,20.83 52.92,22.13 52.92,24.21 53.61,24.89 v53.72,24.89 53.94,24.67 54.05,24.67 54.09,24.64 R29.1 | v24.64,21.34 25.59,21.34 27.31,19.61 43.62,19.61 46.6,22.6 47.28,22.6 49.58,24.89 v50.16,24.89
  Bottom 0.381: v15.75,31.24 15.97,31.02 15.97,30.91 16.7,30.18 16.7,28.08 23.45,21.34 v24.64,21.34 | v50.16,24.89 v53.72,24.89
N$53
  Top 0.381: Q2.1 45.28,4.51 R13.2 R12.2
N$54  (via drill 0.4)
  Top 0.292: IC1.19 15.99,32.15 16.76,31.37 v16.76,31.24
  Top 0.381: R33.1 54.23,29.72 52.92,28.41 52.92,26.59 53.61,25.91 v53.72,25.91 R28.1 | v24.64,22.35 25.4,22.35 27.56,20.19 43.37,20.19 46.36,23.18 47.04,23.18 49.77,25.91 v50.16,25.91
  Bottom 0.381: v16.76,31.24 17.29,30.72 17.29,28.32 23.26,22.35 v24.64,22.35 | v50.16,25.91 v53.72,25.91
N$55  (via drill 0.4)
  Top 0.508: v49.91,2.16 Q1.3 49.91,8.89 50.16,9.14 J1.2
  Bottom 0.635: v49.91,2.16 CON3.1
N$56  (via drill 0.4)
  Top 0.292: IC1.1 10.58,39.84 9.78,40.64 v9.27,40.64
  Top 0.381: C23.2 59.44,17.59 R40.2 59.5,19.15 59.56,19.21 | v24.64,20.32 25.78,20.32 27.07,19.02 43.86,19.02 44.43,19.6 44.87,19.6 v45.09,19.81 | v47.88,17.53 47.88,17.93 49.16,19.21 59.56,19.21 | R42.2 R41.2 61.34,12.32 61.98,12.95 D6.3 60.67,18.7 60.17,19.21 59.56,19.21
  Bottom 0.381: v9.27,40.64 14.86,35.05 14.86,31 15.42,30.45 15.61,30.45 16.12,29.93 16.12,27.84 23.64,20.32 v24.64,20.32 | v45.09,19.81 47.37,17.53 v47.88,17.53
N$57  (via drill 0.4)
  Top 0.292: IC1.20 16.49,32.66 17.4,31.75 v17.65,31.75
  Top 0.381: R32.1 R27.1 53.98,27.18 v53.72,26.92 | v24.64,23.37 25.21,23.37 27.8,20.78 43.13,20.78 46.12,23.77 46.8,23.77 49.96,26.92 v50.16,26.92
  Bottom 0.381: v17.65,31.75 17.87,31.53 17.87,28.56 23.07,23.37 v24.64,23.37 | v50.16,26.92 v53.72,26.92
N$58  (via drill 0.4)
  Top 0.381: R15.1 43.49,4.51 Q3.2 43.49,6.67 43.69,6.86 v43.69,8 | Q2.2 47.18,6.67 47.37,6.86 v47.37,8 | v50.93,7.49 50.93,5.87 Q1.2
  Bottom 0.635: v43.69,8 v47.37,8 47.88,7.49 v50.93,7.49
N$59
  Top 0.381: R16.1 40.77,9.84 41.34,9.27 42.16,9.27 42.55,8.89 Q3.3
N$60  (via drill 0.4)
  Top 0.381: CON2.6 27.94,58.67 27.94,56.77 26.49,55.32 26.49,40.31 v27.18,39.62 | R5.1 25.91,33.78 26.42,33.27 v27.18,33.27
  Bottom 0.381: v27.18,33.27 v27.18,39.62
N$61
  Top 0.292: IC1.33 20.41,39.84 20.57,40.01 20.57,41.53
  Top 0.381: R2.2 R1.1 19.18,45.47 20.57,44.07 20.57,41.53
N$62  (via drill 0.4)
  Top 0.292: IC1.21 16.99,32.92 17.4,32.51 v18.41,32.51
  Top 0.381: R31.1 R30.1 54.23,23.37 v53.72,23.88 | v24.64,24.38 25.02,24.38 28.04,21.36 42.89,21.36 45.88,24.35 46.56,24.35 49.37,27.16 49.37,27.38 49.93,27.94 v50.16,27.94
  Bottom 0.381: v18.41,32.51 18.41,32.12 18.46,32.07 18.46,28.8 22.88,24.38 v24.64,24.38 | v53.72,23.88 53.5,24.09 49.84,24.09 49.37,24.56 49.37,27.25 50.05,27.94 v50.16,27.94
N$63  (via drill 0.4)
  Top 0.381: MOD1.17 41.15,26.52 R9.1 42.29,24.13 43.31,25.15 v43.31,25.4 | CON2.10 17.65,58.8 19.45,58.8 20.19,58.06 20.19,57.01 20.94,56.26 22.65,56.26 22.96,55.95 22.96,54.24 23.19,54.01 23.19,42.62 22.86,42.29 v22.86,42.16 | v46.23,25.15 45.85,25.15 42.65,21.95 28.28,21.95 24.31,25.92 24.31,29.86 25.15,30.7 v25.15,30.86
  Bottom 0.381: v46.23,25.15 43.56,25.15 v43.31,25.4 | v25.15,30.86 24.93,31.08 24.93,31.65 24.55,32.03 24.55,38.77 22.86,40.47 v22.86,42.16
N$64  (via drill 0.4)
  Top 0.292: IC1.13 12.99,32.67 12.81,32.5 10.84,32.5 10.1,31.75 9.4,31.75
  Top 0.381: R4.2 C8.2 7.65,25.4 IC2.2 7.43,24.57 6.99,24.13 5.08,24.13 4.57,24.64 4.57,31.75 | CON1.5 8.76,56.52 5.02,52.77 5.02,43.57 5.37,43.22 5.37,40.81 v5.33,40.77 7.38,40.77 7.92,41.31 8.8,41.31 9.91,42.42 9.91,48.24 11.98,50.32 15.14,50.32 v15.37,50.55 | v5.33,37.59 4.95,37.59 4.57,37.21 4.57,31.75 | 9.4,31.75 4.57,31.75 | v41.78,54.61 41.78,59.56 40.39,60.96 29.59,60.96 28.52,59.89 28.52,56.53 27.3,55.31 v27.3,54.61 | v17.4,50.55 17.4,49.73 17.65,49.48 20.67,49.48 20.97,49.78 20.97,52.45 22.1,53.58 v22.1,54.61
  Bottom 0.381: v5.33,40.77 v5.33,37.59 | SW1.4 SW1.1 41.84,54.66 v41.78,54.61 | v22.1,54.61 24.4,54.61 24.69,54.32 26.32,54.32 26.61,54.61 v27.3,54.61 | v17.4,50.55 v15.37,50.55
N$65  (via drill 0.4)
  Top 0.292: IC4.5 56.88,40.91 57.66,40.13 v57.78,40.13
  Top 0.635: L1.2 59.16,38.76 v57.78,40.13
N$66  (via drill 0.4)
  Top 0.292: IC1.39 14.99,42.67 15.11,42.8 v15.11,43.56 | IC4.4 52.59,40.91 52.45,40.77 R23.2
  Top 0.381: v21.08,30.86 21.08,30.61 21.97,29.72 21.97,19.38 23.58,17.77 25.02,17.77 26.1,16.69 30.3,16.69 v30.61,16.38 | v51.05,36.7 51.05,36.96 52.45,38.35 R23.2 | v51.05,34.67 51,34.62 51,24.54 47.16,20.7 v46.61,20.7
  Bottom 0.381: v15.11,43.56 15.11,43.32 18.02,40.41 19.61,40.41 22.21,37.81 22.21,32.36 21.08,31.23 v21.08,30.86 | v51.05,36.7 v51.05,34.67 | v30.61,16.38 34.92,20.7 v46.61,20.7
UVCC  (via drill 0.4)
  Top 0.292: IC1.7 10.11,36.84 9.48,36.21 7.86,36.21 v7.62,36.45 | v7.62,40.01 7.73,40.01 8,39.74 9.86,39.74 10.26,39.34 IC1.2
  Top 0.381: C13.2 18.41,4.83 18.67,4.57 18.67,3.05
  Top 0.508: v7.62,40.01 7.51,39.89 4.62,39.89 2.76,38.03 2.76,17.06 6.6,13.21 9.51,13.21 10.74,11.98 12.79,11.98 14.91,9.86 14.91,6.84 14.02,5.96 14.02,1.85 14.35,1.52 18.16,1.52 18.48,1.85 18.48,3.01 F1.2 18.67,3.05 D1.2
  Bottom 0.381: v7.62,40.01 v7.62,36.45
VCC  (via drill 0.4)
  Top 0.292: IC1.14 13.49,32.28 13.21,32 11.05,32 9.84,30.8 | IC1.24 19.91,35.34 v20.19,35.05 | IC1.44 12.49,41.74 11.68,42.55 v10.79,42.55 | IC1.34 17.49,41.36 18.41,42.29 18.97,42.29 19.94,43.26 19.94,43.94 19.52,44.36 17.62,44.36 | IC4.8 56.88,42.41 57.66,43.18 v57.78,43.18 | IC5.8 61.55,26.25 61.72,26.42 61.72,26.92 61.34,27.3 58.04,27.3 57.66,27.69 C21.2
  Top 0.381: IC2.1 5.53,29.02 C7.2 5.71,30.61 6.26,31.15 9.49,31.15 9.84,30.8 v10.29,30.35 C1.2 C2.2 R4.1 | C16.2 C17.2 27.05,13.43 | R26.2 39.81,4.51 Q4.2 39.81,6.67 40.13,6.99 v40.13,8 | Q2.3 v46.23,9.27 | CON1.2 CON2.5 | 17.62,44.36 15.75,44.36 | 15.75,44.36 14.35,44.36 | R1.2 15.75,44.36 | R3.2 14.35,44.36 | 10.79,44.58 11.01,44.36 14.35,44.36 | v57.78,37.59 57.53,37.34 C19.2 | D6.2 62.93,15.31 v62.99,15.24 | R33.2 C22.2 | R32.2 C21.2 C22.2 | R38.1 v65.15,24.64 | C22.2 v57.66,30.86 | R31.2 v57.53,22.1
  Top 0.635: D3.1 D4.1 32.24,7.99 v32.26,8 32.26,9.65 28.7,13.21 v28.7,13.46 28.67,13.43 27.05,13.43 21.33,13.43 20.57,14.19 20.57,23.37 | v10.79,42.55 10.79,44.58 10.79,48.12 12.28,49.61 15.75,49.61 15.76,49.62 15.88,49.62 16.38,50.13 16.38,54.61 | 16.38,54.61 CON2.5 | v19.56,54.61 16.38,54.61 | 20.57,23.37 v20.57,27.94 | v12.19,23.37 20.57,23.37 | v57.78,43.18 59.16,44.56 L1.1 | v47.88,26.8 47.88,35.05 48.51,35.69 57.78,35.69 | v57.66,32.51 57.78,32.64 57.78,35.69 | v57.78,37.59 57.78,35.69 | v52.45,16.26 54.23,16.26 57.78,12.7 | R41.1 57.78,12.7 | v59.44,14.35 57.78,12.7
  Bottom 0.457: v20.57,27.94 20.46,27.82 19.08,29.21 19.08,31.96 19.36,32.24 19.36,35 19.3,35.05
  Bottom 0.635: v32.26,8 v40.13,8 40.1,7.97 40.1,7.62 40.64,7.08 41.88,7.08 42.51,7.71 42.51,8.13 43.3,8.93 45.88,8.93 v46.23,9.27 | v12.19,23.37 11.68,23.37 11.27,23.78 11.27,29.37 v10.29,30.35 | v28.7,13.46 28.7,17.91 33.02,22.23 47.88,22.23 | CON2.3 21.46,56.9 19.56,54.99 v19.56,54.61 | v20.19,35.05 19.3,35.05 18.92,35.05 15.49,38.48 14.86,38.48 v10.79,42.55 | v57.78,37.59 58.04,37.59 58.8,38.35 58.8,42.45 58.04,43.22 57.82,43.22 v57.78,43.18 | 47.88,22.23 48.9,22.23 50.93,20.19 v50.93,17.78 v52.45,16.26 | 47.88,22.23 v47.88,26.8 | 57.57,22.06 62.58,22.06 v65.15,24.64 | v57.53,22.1 57.57,22.06 | v57.66,32.51 v57.66,30.86 57.66,22.16 57.57,22.06 | v59.44,14.35 59.47,14.32 62.07,14.32 v62.99,15.24
VEXT
  Top 0.381: 50.04,10.41 52.07,10.41
  Top 0.635: D2.2 21.08,5.21 21.72,4.57 21.72,1.78 22.43,1.07 50.12,1.07 51.94,2.88 51.94,7.11 52.83,8 52.83,10.16 52.58,10.41 52.07,10.41 | CON5.8 46.16,13.66 49.4,10.41 50.04,10.41

### Text on the board
bNames: CON5 | IN | GND | B | A | GND | VOUT | GND | VIN